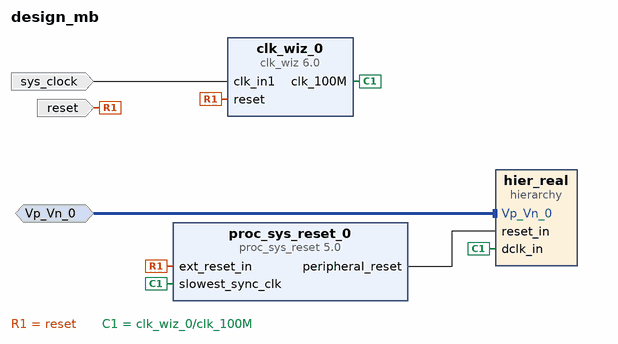
[diagram p0: block diagram of the top level]
# Vivado block design design_mb, xc7a35tcpg236-1, Vivado 2018.2
create_bd_design design_mb

create_bd_intf_port -mode Slave -vlnv xilinx.com:interface:diff_analog_io_rtl:1.0 Vp_Vn_0
create_bd_port -dir I -type rst reset
set_property -dict {CONFIG.POLARITY ACTIVE_HIGH} [get_bd_ports reset]
create_bd_port -dir I -type clk sys_clock
set_property -dict {CONFIG.FREQ_HZ 100000000 CONFIG.PHASE 0.000} [get_bd_ports sys_clock]

create_bd_cell -type hier hier_real
create_bd_cell -type ip -vlnv xilinx.com:ip:clk_wiz:6.0 clk_wiz_0
set_property -dict [list \
  CONFIG.CLK_OUT1_PORT clk_100M \
  CONFIG.USE_LOCKED false \
  CONFIG.USE_BOARD_FLOW true \
  CONFIG.CLK_IN1_BOARD_INTERFACE sys_clock \
  CONFIG.RESET_BOARD_INTERFACE reset \
] [get_bd_cells clk_wiz_0]
create_bd_cell -type ip -vlnv xilinx.com:ip:proc_sys_reset:5.0 proc_sys_reset_0
set_property -dict {CONFIG.USE_BOARD_FLOW true CONFIG.RESET_BOARD_INTERFACE reset} [get_bd_cells proc_sys_reset_0]

# ---- hierarchy /hier_real ----
current_bd_instance /hier_real
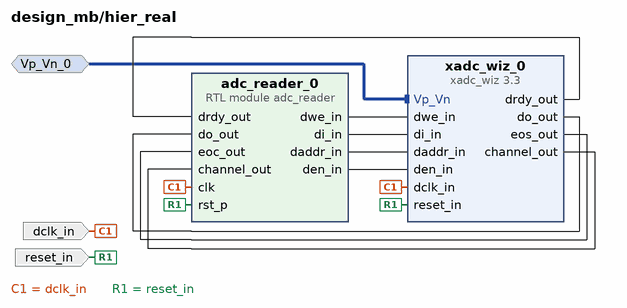
[diagram p1: block diagram inside /hier_real]
create_bd_intf_pin -mode Slave -vlnv xilinx.com:interface:diff_analog_io_rtl:1.0 Vp_Vn_0
create_bd_pin -dir I -type clk dclk_in
create_bd_pin -dir I reset_in

create_bd_cell -type ip -vlnv xilinx.com:ip:xadc_wiz:3.3 xadc_wiz_0
set_property -dict [list \
  CONFIG.INTERFACE_SELECTION ENABLE_DRP \
  CONFIG.XADC_STARUP_SELECTION channel_sequencer \
  CONFIG.SEQUENCER_MODE Continuous \
  CONFIG.ENABLE_RESET true \
  CONFIG.OT_ALARM false \
  CONFIG.USER_TEMP_ALARM false \
  CONFIG.VCCINT_ALARM false \
  CONFIG.VCCAUX_ALARM false \
  CONFIG.SINGLE_CHANNEL_SELECTION TEMPERATURE \
  CONFIG.EXTERNAL_MUX_CHANNEL VP_VN \
  CONFIG.CHANNEL_ENABLE_VP_VN true \
] [get_bd_cells xadc_wiz_0]
create_bd_cell -type module -reference adc_reader adc_reader_0

# ---- connections ----

current_bd_instance /hier_real
connect_bd_intf_net [get_bd_intf_pins Vp_Vn_0] [get_bd_intf_pins xadc_wiz_0/Vp_Vn]
connect_bd_net [get_bd_pins dclk_in] [get_bd_pins xadc_wiz_0/dclk_in] [get_bd_pins adc_reader_0/clk]
connect_bd_net [get_bd_pins reset_in] [get_bd_pins xadc_wiz_0/reset_in] [get_bd_pins adc_reader_0/rst_p]
connect_bd_net [get_bd_pins xadc_wiz_0/drdy_out] [get_bd_pins adc_reader_0/drdy_out]
connect_bd_net [get_bd_pins xadc_wiz_0/do_out] [get_bd_pins adc_reader_0/do_out]
connect_bd_net [get_bd_pins xadc_wiz_0/eos_out] [get_bd_pins adc_reader_0/eoc_out]
connect_bd_net [get_bd_pins xadc_wiz_0/channel_out] [get_bd_pins adc_reader_0/channel_out]
connect_bd_net [get_bd_pins adc_reader_0/dwe_in] [get_bd_pins xadc_wiz_0/dwe_in]
connect_bd_net [get_bd_pins adc_reader_0/di_in] [get_bd_pins xadc_wiz_0/di_in]
connect_bd_net [get_bd_pins adc_reader_0/daddr_in] [get_bd_pins xadc_wiz_0/daddr_in]
connect_bd_net [get_bd_pins adc_reader_0/den_in] [get_bd_pins xadc_wiz_0/den_in]

current_bd_instance /
connect_bd_intf_net -intf_net Vp_Vn_0_1 [get_bd_intf_ports Vp_Vn_0] [get_bd_intf_pins hier_real/Vp_Vn_0]
connect_bd_net [get_bd_ports reset] [get_bd_pins clk_wiz_0/reset] [get_bd_pins proc_sys_reset_0/ext_reset_in]
connect_bd_net [get_bd_ports sys_clock] [get_bd_pins clk_wiz_0/clk_in1]
connect_bd_net [get_bd_pins clk_wiz_0/clk_100M] [get_bd_pins proc_sys_reset_0/slowest_sync_clk] [get_bd_pins hier_real/dclk_in]
connect_bd_net [get_bd_pins proc_sys_reset_0/peripheral_reset] [get_bd_pins hier_real/reset_in]

validate_bd_design
save_bd_design
